# EasyEDA Pro project 功率计pcb.epro

# Schematic Schematic1
Board Name: Board1; Create Date: 2025-11-07; Page Name: P1; Project Name: 【单片机】STM32F103C8T6功率计; Schematic Name: Schematic1; Update Date: 2025-11-07; Company: 嘉立创EDA; Page Size: A4; Version: V1.0
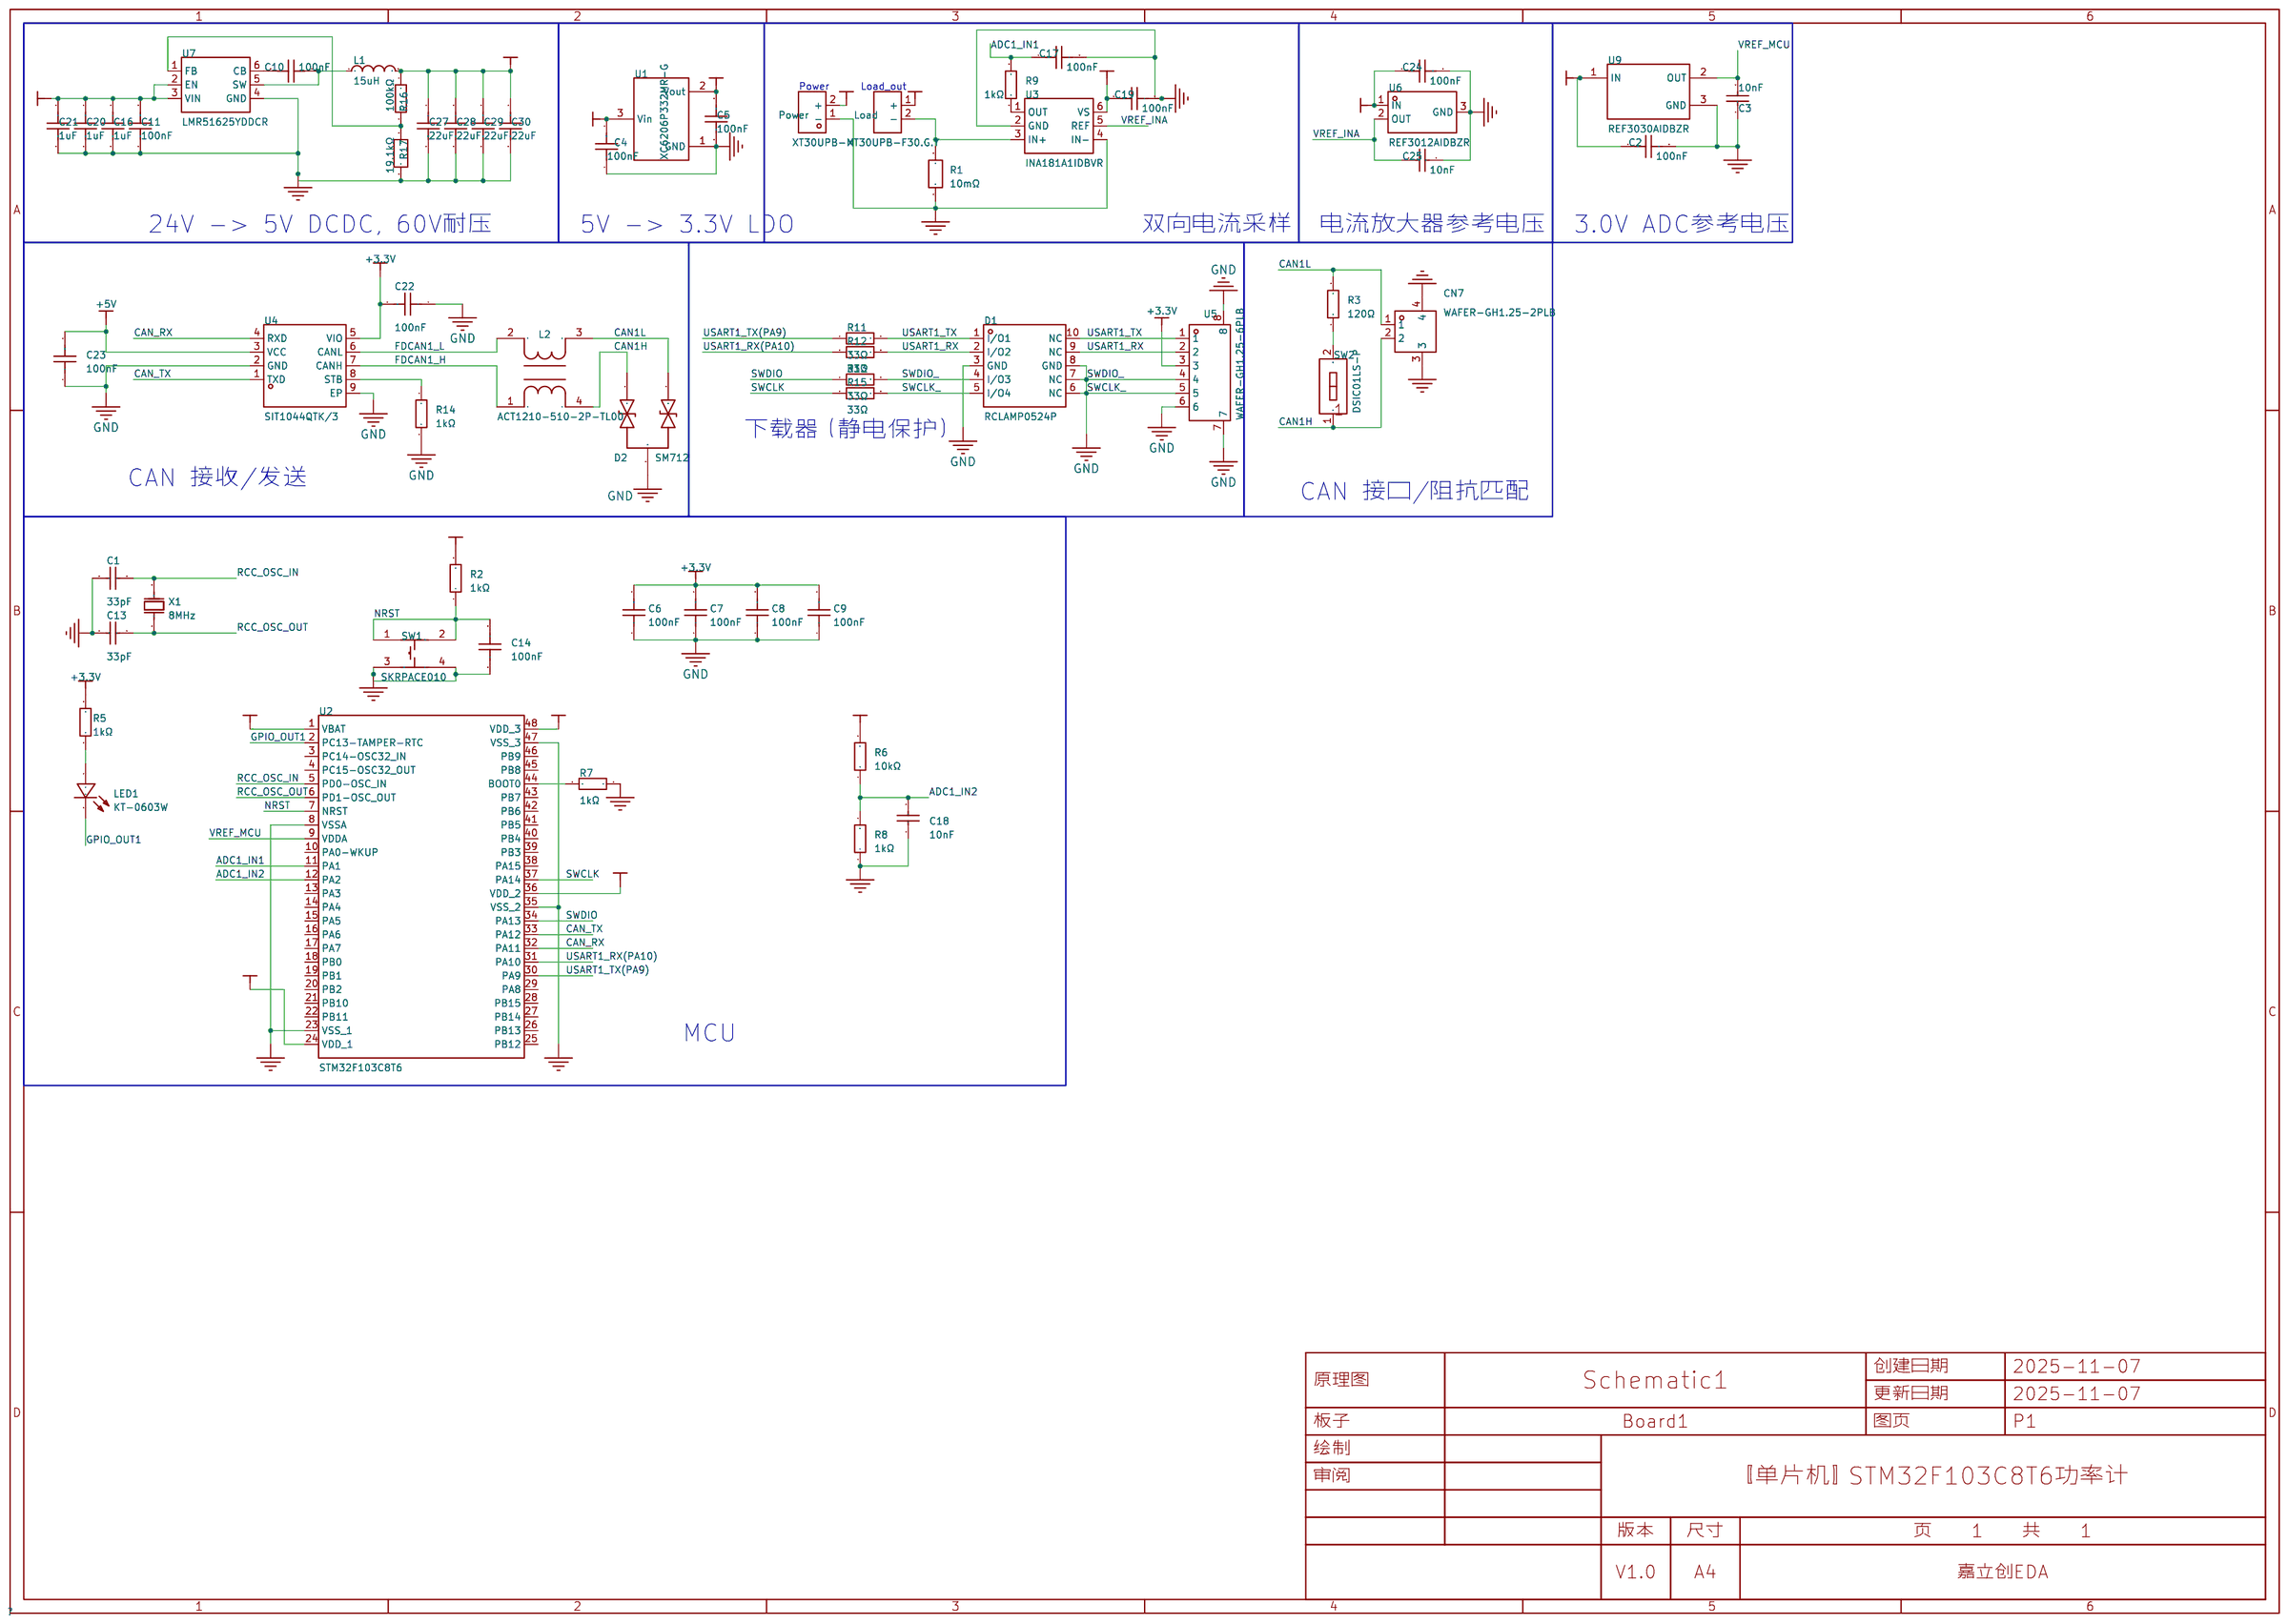
[diagram p0: schematic sheet]

## Parts
C1  33pF  [C0603]
C2  100nF  [C0603]
C3  10nF  [C0603]
C4  100nF  [C0603]
C5  100nF  [C0603]
C6  100nF  [C0603]
C7  100nF  [C0603]
C8  100nF  [C0603]
C9  100nF  [C0603]
C10  100nF  [C0603]
C11  100nF  [C0603]
C13  33pF  [C0603]
C14  100nF  [C0603]
C16  1uF  [C0603]
C17  100nF  [C0603]
C18  10nF  [C0603]
C19  100nF  [C0603]
C20  1uF  [C0603]
C21  1uF  [C0603]
C22  100nF  [C0603]
C23  100nF  [C0603]
C24  100nF  [C0603]
C25  10nF  [C0603]
C27  22uF  [C0603]
C28  22uF  [C0603]
C29  22uF  [C0603]
C30  22uF  [C0603]
CN7  WAFER-GH1.25-2PLB  [CONN-TH_2P-P1.25_XUNPU_WAFER-GH1.25-2PLB]
D1  RCLAMP0524P  [DFN2510-10_L2.5-W1.0-P0.50-BL]
D2  SM712  [SOT-23-3_L2.9-W1.3-P1.90-LS2.4-BR]
L1  15uH  [IND-SMD_L5.7-W5.2_GSM0530]
L2  ACT1210-510-2P-TL00  [FILTER-SMD_4P-L3.2-W2.5-BL_ACT1210]
LED1  KT-0603W  [LED0603-R-RD_WHITE]
Load  XT30UPB-F30.G.Y  [CONN-TH_XT30UPB-F]
Power  XT30UPB-M  [CONN-TH_XT30UPB-M]
R1  10mΩ  [R2512]
R2  1kΩ  [R0603]
R3  120Ω  [R0603]
R5  1kΩ  [R0603]
R6  10kΩ  [R0603]
R7  1kΩ  [R0603]
R8  1kΩ  [R0603]
R9  1kΩ  [R0603]
R11  33Ω  [R0603]
R12  33Ω  [R0603]
R13  33Ω  [R0603]
R14  1kΩ  [R0603]
R15  33Ω  [R0603]
R16  100kΩ  [R0603]
R17  19.1kΩ  [R0603]
SW1  SKRPACE010  [KEY-SMD_4P-L4.2-W3.2-P2.20-LS4.6]
SW2  DSIC01LS-P  [SW-SMD_2P-L3.5-W6.1-P2.54-LS9.8]
U1  XC6206P332MR-G  [SOT-23-3_L2.9-W1.6-P1.90-LS2.8-BR]
U2  STM32F103C8T6  [LQFP-48_L7.0-W7.0-P0.50-LS9.0-BL]
U3  INA181A1IDBVR  [SOT-23-6_L2.9-W1.6-P0.95-LS2.8-TL]
U4  SIT1044QTK/3  [TDFN-8_L3.0-W3.0-P0.65-BL-EP]
U5  WAFER-GH1.25-6PLB  [CONN-SMD_6P-P1.25_XUNPU_WAFER-GH1.25-6PLB]
U6  REF3012AIDBZR  [SOT-23-3_L2.9-W1.3-P1.90-LS2.4-BR]
U7  LMR51625YDDCR  [SOT-23-6_L2.9-W1.6-P0.95-LS2.8-BL]
U9  REF3030AIDBZR  [SOT-23-3_L2.9-W1.6-P1.90-LS2.8-BR]
X1  8MHz  [CRYSTAL-SMD_L5.0-W3.2]

## Library data of the parts
C1 C13 = CL10C330JB8NNNC: 容值:33pF;精度:±5%;额定电压:50V;温度系数:C0G;; LCSC Part Name: 33pF ±5% 50V; Supplier Part: C1663; Manufacturer: SAMSUNG(三星); Supplier Footprint: 0603; JLCPCB Part Class: Basic Part; Datasheet: https://item.szlcsc.com/datasheet/CL10C330JB8NNNC/2015.html; Supplier: LCSC; Tolerance: ±5%; Voltage Rating: 50V; Temperature Coefficient: C0G
C2 C4 C5 C10 C11 C14 C17 C19 C22-C24 = CC0603KRX7R9BB104: 容值:100nF;精度:±10%;额定电压:50V;温度系数:X7R;; LCSC Part Name: 100nF ±10% 50V; Supplier Part: C14663; Manufacturer: YAGEO(国巨); Supplier Footprint: 0603; JLCPCB Part Class: Basic Part; Datasheet: https://item.szlcsc.com/datasheet/CC0603KRX7R9BB104/15331.html; Supplier: LCSC; Tolerance: ±10%; Voltage Rating: 50V; Temperature Coefficient: X7R
C3 C18 C25 = 0603B103K500NT: 容值:10nF;精度:±10%;额定电压:50V;温度系数:X7R;; LCSC Part Name: 10nF ±10% 50V; Supplier Part: C57112; Manufacturer: FH(风华); Supplier Footprint: 0603; JLCPCB Part Class: Basic Part; Datasheet: https://item.szlcsc.com/datasheet/0603B103K500NT/58143.html; Supplier: LCSC; Tolerance: ±10%; Voltage Rating: 50V; Temperature Coefficient: X7R
C6-C9 = CC0603KRX7R9BB104: 容值:100nF;精度:±10%;额定电压:50V;材质(温度系数):X7R;; LCSC Part Name: 100nF ±10% 50V; Supplier Part: C14663; Manufacturer: YAGEO(国巨); Supplier Footprint: 0603; JLCPCB Part Class: Basic Part; Datasheet: https://atta.szlcsc.com/upload/public/pdf/source/20180910/C282072_33301C7F631E79921B82A8DAC6BCC5B3.pdf; Supplier: LCSC; Tolerance: ±10%; Voltage Rating: 50V; Temperature Coefficient: X7R; Voltage Rated: 50V
C16 C20 C21 = CL10A105KB8NNNC: 容值:1uF;精度:±10%;额定电压:50V;温度系数:X5R;; LCSC Part Name: 1uF ±10% 50V; Supplier Part: C15849; Manufacturer: SAMSUNG(三星); Supplier Footprint: 0603; JLCPCB Part Class: Basic Part; Datasheet: https://item.szlcsc.com/datasheet/CL10A105KB8NNNC/16531.html; Supplier: LCSC; Tolerance: ±10%; Voltage Rating: 50V; Temperature Coefficient: X5R
C27-C30 = CL10A226MQ8NRNC: 容值:22uF;精度:±20%;额定电压:6.3V;温度系数:X5R;; LCSC Part Name: 22uF ±20% 6.3V; Supplier Part: C59461; Manufacturer: SAMSUNG(三星); Supplier Footprint: 0603; JLCPCB Part Class: Basic Part; Datasheet: https://item.szlcsc.com/datasheet/CL10A226MQ8NRNC/60514.html; Supplier: LCSC; Tolerance: ±20%; Voltage Rating: 6.3V; Temperature Coefficient: X5R
CN7 = WAFER-GH1.25-2PLB: 插针结构:1x2P;间距:1.25mm;安装方式:立贴;参考系列:GH;总PIN数:2P;排数:1;每排PIN数:2;额定电流:1A;工作温度范围:-25℃~+85℃;; LCSC Part Name: 1x2P 间距:1.25mm 立贴 系列:GH; Supplier Part: C3029368; Manufacturer: XUNPU(讯普); Supplier Footprint: SMD,P=1.25mm; JLCPCB Part Class: 扩展库; Datasheet: https://atta.szlcsc.com/upload/public/pdf/source/20220527/44F824AAC8C2B617205E15955FF9C23D.pdf; Supplier: LCSC; Pins Structure: 1x2P; Pitch: 1.25mm; Mounting Style: 立贴; Reference Series: GH; Number of Pins: 2P; Number of Rows: 1; Number of PINs Per Row: 2; Current Rating (Max): 1A; Operating Temperature Range: -25℃~+85℃
D1 = RCLAMP0524P_C907837: 极性:单向;反向截止电压(Vrwm):5V;最大钳位电压:17V;峰值脉冲电流(Ipp):4.5A;击穿电压:6.8V;; Supplier Part: C907837; Manufacturer: TECH PUBLIC(台舟); Supplier Footprint: DFN2510-10; JLCPCB Part Class: 扩展库; Datasheet: https://atta.szlcsc.com/upload/public/pdf/source/20210810/AE3DE9AC94AD2A317FD9BEA10653400F.pdf; Supplier: LCSC; polarity: 单向; Reverse Stand-Off Voltage (Vrwm): 5V; Maximum Clamping Voltage: 17V; Peak Pulse Current (Ipp): 4.5A; Breakdown Voltage: 6.8V; Reverse Leakage Current (Ir): 80nA; Number of Lines: 四路; Operating Temperature: -55℃~+125℃; level of protection: IEC 61000-4-2; Type: ESD
D2 = SM712_C521963: 极性:双向;反向截止电压(Vrwm):12V；7V;最大钳位电压:15V；25V;峰值脉冲电流(Ipp):7A;峰值脉冲功率(Ppp):150W;击穿电压:7.5V；13.3V;; Supplier Part: C521963; Manufacturer: TECH PUBLIC(台舟); Supplier Footprint: SOT-23; JLCPCB Part Class: 扩展库; Datasheet: https://atta.szlcsc.com/upload/public/pdf/source/20210810/E76C7C1824B0CB2A5B8963B3ABCE2DCE.pdf; Supplier: LCSC; polarity: 双向; Reverse Stand-Off Voltage (Vrwm): 12V；7V; Maximum Clamping Voltage: 15V；25V; Peak Pulse Current (Ipp): 7A; Peak Pulse Power Dissipation (Ppp): 150W; Breakdown Voltage: 7.5V；13.3V; Reverse Leakage Current (Ir): 500nA；10nA; Number of Lines: 双路; Operating Temperature: -55℃~+125℃; level of protection: IEC 61000-4-2; Type: ESD
L1 = SRG0530-150-M: 电感值:15uH;精度:±20%;额定电流:2.5A;饱和电流(Isat):3A;类型:一体成型电感;; LCSC Part Name: 15μH ±20% 3A; Supplier Part: C53462979; Manufacturer: JIERR(捷而瑞); Supplier Footprint: SMD,5.7x5.2mm; JLCPCB Part Class: Extended Part; Datasheet: https://item.szlcsc.com/datasheet/SRG0530-150-M/56628174.html; Supplier: LCSC; Tolerance: ±20%; Current Rating: 2.5A; Current - Saturation(Isat): 3A; DC Resistance(DCR): 218mΩ; Type: 一体成型电感
L2 = ACT1210-510-2P-TL00: 线路数:2;电感 @ 频率:51uH@100kHz;阻抗 @ 频率:2.6kΩ@10MHz;直流电阻(DCR):700mΩ;; LCSC Part Name: 两路 共模滤波器 阻抗2.6kΩ@10MHz; Supplier Part: C95572; Manufacturer: TDK; Supplier Footprint: 3.2x2.5mm; JLCPCB Part Class: 扩展库; Datasheet: https://atta.szlcsc.com/upload/public/pdf/source/20171113/C95572_15105616815011116176.pdf; Supplier: LCSC; Number of Lines: 2; Current Rating: 200mA; Inductance @ Frequency: 51uH@100kHz; Voltage Rating - DC: 80V; Impedance @ Frequency: 2.6kΩ@10MHz; DC Resistance (DCR): 700mΩ; Operating Temperature: -55℃~+150℃
LED1 = KT-0603W: 发光颜色:白色;; LCSC Part Name: 0603 白灯 高亮; Supplier Part: C2290; Manufacturer: KENTO; Supplier Footprint: 0603; JLCPCB Part Class: 基础库; Datasheet: https://atta.szlcsc.com/upload/public/pdf/source/20221101/4C23D5C85BA051E44A00B833D0A41468.pdf; Supplier: LCSC; Emitted Color: 白色
Load = XT30UPB-F30.G.Y: 类别:-;类型1:-;; LCSC Part Name: AMASS(艾迈斯)直立焊板式连接器XT30UPB30-F.G.*; Supplier Part: C108769; Manufacturer: AMASS(艾迈斯); JLCPCB Part Class: Extended Part; Datasheet: https://item.szlcsc.com/datasheet/XT30UPB-F30.G.Y/109989.html; Supplier: LCSC; Type: 航模插头; Colour: 黄色; RatedVoltage: DC 500V; InterfaceType: 母头; MetalMaterial: 镀金; InsulationMaterial: PA; RatedCurrent: 15A; contact resistance: 0.65mΩ
Power = XT30UPB-M: 类别:-;类型1:-;; LCSC Part Name: AMASS(艾迈斯)板载立式 航模锂电池控制器连接器插头 公头XT30UPB-M; Supplier Part: C428721; Manufacturer: AMASS(艾迈斯); JLCPCB Part Class: Extended Part; Datasheet: https://item.szlcsc.com/datasheet/XT30UPB-M/423831.html; Supplier: LCSC; Type: 航模插头; Colour: 黄色; RatedVoltage: DC 500V; InterfaceType: 公头; MetalMaterial: 镀金; InsulationMaterial: PA; RatedCurrent: 15A; contact resistance: 0.65mΩ
R1 = RE2512F3R010: 电阻类型:采样电阻；合金电阻;阻值:10mΩ;精度:±1%;功率:3W;温度系数:±50ppm/℃;; LCSC Part Name: 10mΩ 3W 2512 ±1%; Supplier Part: C46961753; Manufacturer: JIERR(捷而瑞); Supplier Footprint: 2512; JLCPCB Part Class: Extended Part; Datasheet: https://item.szlcsc.com/datasheet/RE2512F3R010/49133292.html; Supplier: LCSC; Type: 采样电阻；合金电阻; Tolerance: ±1%; Power(Watts): 3W; Temperature Coefficient: ±50ppm/℃
R2 R5 R7-R9 R14 = 0603WAF1001T5E: 电阻类型:厚膜电阻;阻值:1kΩ;精度:±1%;功率:100mW;最大工作电压:75V;温度系数:±100ppm/℃;; LCSC Part Name: 1kΩ ±1% 100mW 厚膜电阻; Supplier Part: C21190; Manufacturer: UNI-ROYAL(厚声); Supplier Footprint: 0603; JLCPCB Part Class: Basic Part; Datasheet: https://atta.szlcsc.com/upload/public/pdf/source/20200306/C422600_1E6D84923E4A46A82E41ADD87F860B5C.pdf; Supplier: LCSC; Type: 厚膜电阻; Tolerance: ±1%; Power(Watts): 100mW; Overload Voltage (Max): 75V; Temperature Coefficient: ±100ppm/℃; Operating Temperature Range: -55℃~+155℃
R3 = 0603WAF1200T5E: 电阻类型:厚膜电阻;阻值:120Ω;精度:±1%;功率:100mW;工作电压:75V;温度系数:±100ppm/℃;; LCSC Part Name: 120Ω ±1% 100mW 厚膜电阻; Supplier Part: C22787; Manufacturer: UNI-ROYAL(厚声); Supplier Footprint: 0603; JLCPCB Part Class: Basic Part; Datasheet: https://item.szlcsc.com/datasheet/0603WAF1200T5E/23514.html; Supplier: LCSC; Type: 厚膜电阻; Tolerance: ±1%; Power(Watts): 100mW; Voltage-Supply(Max): 75V; Temperature Coefficient: ±100ppm/℃; Operating Temperature: -55℃~+155℃
R6 = 0603WAF1002T5E: 电阻类型:厚膜电阻;阻值:10kΩ;精度:±1%;功率:100mW;工作电压:75V;温度系数:±100ppm/℃;; LCSC Part Name: 厚膜电阻 10kΩ ±1% 100mW; Supplier Part: C25804; Manufacturer: UNI-ROYAL(厚声); Supplier Footprint: 0603; JLCPCB Part Class: Basic Part; Datasheet: https://item.szlcsc.com/datasheet/0603WAF1002T5E/26547.html; Supplier: LCSC; Type: 厚膜电阻; Tolerance: ±1%; Power(Watts): 100mW; Voltage-Supply(Max): 75V; Temperature Coefficient: ±100ppm/℃; Operating Temperature: -55℃~+155℃
R11-R13 R15 = 0603WAF330JT5E: 电阻类型:厚膜电阻;阻值:33Ω;精度:±1%;功率:100mW;工作电压:75V;温度系数:±100ppm/℃;; LCSC Part Name: 33Ω ±1% 100mW 厚膜电阻; Supplier Part: C23140; Manufacturer: UNI-ROYAL(厚声); Supplier Footprint: 0603; JLCPCB Part Class: Basic Part; Datasheet: https://item.szlcsc.com/datasheet/0603WAF330JT5E/23867.html; Supplier: LCSC; Type: 厚膜电阻; Tolerance: ±1%; Power(Watts): 100mW; Voltage-Supply(Max): 75V; Temperature Coefficient: ±100ppm/℃; Operating Temperature: -55℃~+155℃
R16 = 0603WAF1003T5E: 电阻类型:厚膜电阻;阻值:100kΩ;精度:±1%;功率:100mW;工作电压:75V;温度系数:±100ppm/℃;; LCSC Part Name: 100kΩ ±1% 100mW 厚膜电阻; Supplier Part: C25803; Manufacturer: UNI-ROYAL(厚声); Supplier Footprint: 0603; JLCPCB Part Class: Basic Part; Datasheet: https://item.szlcsc.com/datasheet/0603WAF1003T5E/26546.html; Supplier: LCSC; Type: 厚膜电阻; Tolerance: ±1%; Power(Watts): 100mW; Voltage-Supply(Max): 75V; Temperature Coefficient: ±100ppm/℃; Operating Temperature: -55℃~+155℃
R17 = FRC0603F1912TS: 电阻类型:厚膜电阻;阻值:19.1kΩ;精度:±1%;功率:100mW;工作电压:75V;温度系数:±100ppm/℃;; LCSC Part Name: 19.1kΩ ±1% 100mW 厚膜电阻; Supplier Part: C2960926; Manufacturer: FOJAN(富捷); Supplier Footprint: 0603; JLCPCB Part Class: Extended Part; Supplier: LCSC; Type: 厚膜电阻; Tolerance: ±1%; Power(Watts): 100mW; Voltage-Supply(Max): 75V; Temperature Coefficient: ±100ppm/℃; Operating Temperature: -55℃~+155℃
SW1 = SKRPACE010: 电路结构:单刀单掷;按钮形状:椭圆形按钮;安装方式:立贴;开关长度:4.2mm;开关宽度:3.2mm;开关高度:2.5mm;触点电流:50mA;额定电压:16V;带灯:-;工作寿命:-;; LCSC Part Name: 4.2*3.2*2.5mm 立贴 轻触开关; Supplier Part: C139797; Manufacturer: ALPSALPINE(阿尔卑斯阿尔派); Supplier Footprint: SMD-4P,4.2x3.2mm; JLCPCB Part Class: Extended Part; Datasheet: https://item.szlcsc.com/datasheet/SKRPACE010/151122.html; Supplier: LCSC; Circuit: 单刀单掷; Actuator Style: 椭圆形按钮; Mounting Type: 立贴; Length: 4.2mm; Width: 3.2mm; Switch Height: 2.5mm; Contact Current: 50mA; Voltage Rating: 16V
SW2 = DSIC01LS-P: 类型:平拨,凸起式;电路结构:单刀单掷;开关位数:1位;额定电流:25mA;额定电压:24V;工作寿命:3千次;颜色:黑色;; LCSC Part Name: 平拨,凸起式 1位拨码开关; Supplier Part: C600988; Manufacturer: XKB Connection(中国星坤); Supplier Footprint: SMD; JLCPCB Part Class: Extended Part; Datasheet: https://item.szlcsc.com/datasheet/DSIC01LS-P/631008.html; Supplier: LCSC; Type: 平拨,凸起式; Circuit: 单刀单掷; Number of Positions: 1位; Termination Style: 鸥翼型; Current Rating: 25mA; Voltage Rating: 24V; Operating Temperature: -20℃~+70℃; Operating Life: 3千次; Color: 黑色
U1 = XC6206P332MR-G_C5446: 输出类型:固定;工作电压:6V;输出电压:3.3V;输出电流:200mA;电源纹波抑制比(PSRR):-;输出极性:正极;; LCSC Part Name: 3.3V 200mA 6V; Supplier Part: C5446; Manufacturer: TOREX(特瑞仕); Supplier Footprint: SOT-23-3L; JLCPCB Part Class: Basic Part; Datasheet: https://item.szlcsc.com/datasheet/XC6206P332MR-G/5896.html; Supplier: LCSC; Output Type: 固定; Voltage - Supply: 6V; Output Voltage: 3.3V; Output Current: 200mA; standby current: 1uA; Features: 过流保护; Operating Temperature: -40℃~+85℃@(Ta); Output Configuration: 正极; Number of Outputs: 1
U2 = STM32F103C8T6: CPU内核:ARM-M3;CPU最大主频:72MHz;应用领域:-;; LCSC Part Name: 主流增强型ARM Cortex-M3 MCU，具有64 KB Flash、72 MHz CPU、电机控制、USB和CAN; Supplier Part: C8734; Manufacturer: ST(意法半导体); Supplier Footprint: LQFP-48(7x7); JLCPCB Part Class: Extended Part; Datasheet: https://item.szlcsc.com/datasheet/STM32F103C8T6/9243.html; Supplier: LCSC; CPU Core: ARM-M3; CPU Maximum Speed: 72MHz; Program Storage Size: 64KB; Program Memory Type: FLASH; Number of I/O: 37; ADC (Bit): 12bit; Voltage - Supply: 2V~3.6V
U3 = INA181A1IDBVR: 放大器数:单路;; Supplier Part: C2058943; Manufacturer: TI(德州仪器); Supplier Footprint: SOT-23-6; JLCPCB Part Class: Extended Part; Datasheet: https://www.ti.com/cn/lit/gpn/ina2181; Supplier: LCSC; Number of Channels: 单路; Supply Current: 260uA; Operating Temperature: -40℃~+125℃
U4 = SIT1044QTK/3: 类型:CAN-FD收发器;数据速率:5Mbps;; Supplier Part: C5308063; Manufacturer: SIT(芯力特); Supplier Footprint: DFN-8(3x3); JLCPCB Part Class: 扩展库; Datasheet: https://atta.szlcsc.com/upload/public/pdf/source/20241105/7D4F6AF505B38E348F613F026F5787F9.pdf; Supplier: LCSC; Type: CAN-FD收发器; Data Rate: 5Mbps; Supply Voltage: 4.75V~5.25V; Operating Temperature: -40℃~+125℃
U5 = WAFER-GH1.25-6PLB: 插针结构:1x6P;间距:1.25mm;安装方式:立贴;参考系列:GH;总PIN数:6P;排数:1;每排PIN数:6;额定电流:1A;工作温度范围:-25℃~+85℃;; LCSC Part Name: 1x6P 间距:1.25mm 立贴 系列:GH; Supplier Part: C3029372; Manufacturer: XUNPU(讯普); Supplier Footprint: SMD,P=1.25mm; JLCPCB Part Class: 扩展库; Datasheet: https://atta.szlcsc.com/upload/public/pdf/source/20220527/44F824AAC8C2B617205E15955FF9C23D.pdf; Supplier: LCSC; Pins Structure: 1x6P; Pitch: 1.25mm; Mounting Style: 立贴; Reference Series: GH; Number of Pins: 6P; Number of Rows: 1; Number of PINs Per Row: 6; Current Rating (Max): 1A; Operating Temperature Range: -25℃~+85℃
U6 = REF3012AIDBZR: 输出类型:固定;工作电压:1.8V~5.5V;输出电压:1.25V;输出电流:25mA;精度:±0.2%;; Supplier Part: C34674; Manufacturer: TI(德州仪器); Supplier Footprint: SOT-23; JLCPCB Part Class: Extended Part; Datasheet: https://www.ti.com/lit/ds/symlink/ref30.pdf; Supplier: LCSC; Output Type: 固定; Voltage - Supply: 1.8V~5.5V; Output Voltage: 1.25V; Output Current: 25mA; Tolerance: ±0.2%; Temperature Coefficient: 75ppm/℃; Reference Type: 串联; Quiescent Current: 50uA; Noise - 1/10Hz to 10Hz: 14uVp-p; Noise - 10Hz to 10kHz: 42uVrms; Operating Temperature: -40℃~+125℃@(Ta)
U7 = LMR51625YDDCR: 功能类型:降压型;工作电压:4.3V~60V;输出电压:800mV~30V;输出电流:2.5A;输出类型:可调;; LCSC Part Name: 降压型 2.5A 4.3V~60V; Supplier Part: C44991044; Manufacturer: TI(德州仪器); Supplier Footprint: SOT-23-6; JLCPCB Part Class: Extended Part; Datasheet: https://www.ti.com.cn/cn/lit/ds/symlink/lmr51625.pdf; Supplier: LCSC; Function: 降压型; Voltage - Supply: 4.3V~60V; Output Voltage: 800mV~30V; Output Current: 2.5A; Frequency - Switching: 1.1MHz; Operating Temperature: -40℃~+150℃@(TJ); Synchronous Rectifier: 是; Topology: 降压式; Quiescent Current: 29uA; Switch tube (built-in/external): 内置; Output Type: 可调
U9 = REF3030AIDBZR: 输出类型:固定;工作电压:3.05V~5.5V;输出电压:3V;输出电流:25mA;精度:±0.2%;; LCSC Part Name: 3.05V~5.5V 串联 50uA 75ppm/℃; Supplier Part: C38423; Manufacturer: TI(德州仪器); Supplier Footprint: SOT-23; JLCPCB Part Class: Extended Part; Datasheet: https://www.ti.com/lit/ds/symlink/ref30.pdf; Supplier: LCSC; Output Type: 固定; Voltage - Supply: 3.05V~5.5V; Output Voltage: 3V; Output Current: 25mA; Tolerance: ±0.2%; Temperature Coefficient: 75ppm/℃; Reference Type: 串联; Quiescent Current: 50uA; Noise - 1/10Hz to 10Hz: 33uVp-p; Noise - 10Hz to 10kHz: 94uVrms; Operating Temperature: -40℃~+125℃@(Ta)
X1 = X50328MSB2GI: 晶振类型:贴片晶振;频率:8MHz;常温频差:±10ppm;负载电容:20pF;频率稳定度:±20ppm;; LCSC Part Name: YSX530GA 8MHZ 2P 5032 20PF ±10PPM -40~85℃ (±20PPM); Supplier Part: C115962; Manufacturer: YXC(扬兴晶振); Supplier Footprint: SMD5032-2P; JLCPCB Part Class: Basic Part; Datasheet: https://item.szlcsc.com/datasheet/X50328MSB2GI/117214.html; Supplier: LCSC; Type: 贴片晶振; Normal temperature Frequency Tolerance: ±10ppm; Load Capacitance: 20pF; Frequency Stability: ±20ppm; Operating Temperature: -40℃~+85℃

## Nets
+3.3V: C2.1 C5.2 C6.2 C7.2 C8.2 C9.2 C19.1 C22.2 C24.1 R2.2 R5.2 U1.2(Vout) U2.1(VBAT) U2.24(VDD_1) U2.36(VDD_2) U2.48(VDD_3) U3.6(VS) U4.5(VIO) U5.3 U6.1(IN) U9.1(IN)
+5V: C4.2 C23.2 C27.1 C28.1 C29.1 C30.1 L1.2 R16.1 U1.3(Vin) U4.3(VCC)
GND: C1.1 C2.2 C3.1 C4.1 C5.1 C6.1 C7.1 C8.1 C9.1 C11.1 C13.1 C14.1 C16.2 C17.2 C18.1 C19.2 C20.2 C21.2 C22.1 C23.1 C24.2 C25.2 C27.2 C28.2 C29.2 C30.2 CN7.3 CN7.4 D1.3(GND) D1.8(GND) D2.3 Power.1(-) R1.1 R7.2 R8.1 R14.2 R17.2 SW1.3 SW1.4 U1.1(GND) U2.8(VSSA) U2.23(VSS_1) U2.35(VSS_2) U2.47(VSS_3) U3.2(GND) U3.4(IN-) U4.2(GND) U4.9(EP) U5.6 U5.7 U5.8 U6.3(GND) U7.4(GND) U9.3(GND)
VCC: C11.2 C16.1 C20.1 C21.1 Load.1(+) Power.2(+) R6.2 U7.2(EN) U7.3(VIN)
ADC1_IN1: C17.1 R9.2 U2.11(PA1)
ADC1_IN2: C18.2 R6.1 R8.2 U2.12(PA2)
CAN1H: CN7.2 D2.2 L2.4 SW2.1(PIN1)
CAN1L: CN7.1 D2.1 L2.3 R3.2
CAN_RX: U2.32(PA11) U4.4(RXD)
CAN_TX: U2.33(PA12) U4.1(TXD)
FDCAN1_H: L2.1 U4.7(CANH)
FDCAN1_L: L2.2 U4.6(CANL)
GPIO_OUT1: LED1.2(K) U2.2(PC13-TAMPER-RTC)
NRST: C14.2 R2.1 SW1.1 SW1.2 U2.7(NRST)
RCC_OSC_IN: C1.2 U2.5(PD0-OSC_IN) X1.2(OSC2)
RCC_OSC_OUT: C13.2 U2.6(PD1-OSC_OUT) X1.1(OSC1)
SWCLK: R15.1 U2.37(PA14)
SWCLK_: D1.5(I/O4) D1.6(NC) R15.2 U5.5
SWDIO: R13.1 U2.34(PA13)
SWDIO_: D1.4(I/O3) D1.7(NC) R13.2 U5.4
USART1_RX: D1.2(I/O2) D1.9(NC) R12.2 U5.2
USART1_RX(PA10): R12.1 U2.31(PA10)
USART1_TX: D1.1(I/O1) D1.10(NC) R11.2 U5.1
USART1_TX(PA9): R11.1 U2.30(PA9)
VREF_INA: C25.1 U3.5(REF) U6.2(OUT)
VREF_MCU: C3.2 U2.9(VDDA) U9.2(OUT)
$1N34: R9.1 U3.1(OUT)
$1N49: Load.2(-) R1.2 U3.3(IN+)
$1N78: R7.1 U2.44(BOOT0)
$1N106: LED1.1(A) R5.1
$1N115: R14.1 U4.8(STB)
$1N164: C10.1 L1.1 U7.5(SW)
$1N165: R16.2 R17.1 U7.1(FB)
$1N182: R3.1 SW2.2(PIN2)
$1N185: C10.2 U7.6(CB)

Not connected (* = marked no-connect by the designer): U2 3(PC14-OSC32_IN) 4(PC15-OSC32_OUT) 10(PA0-WKUP) 13(PA3) 14(PA4) 15(PA5) 16(PA6) 17(PA7) 18(PB0) 19(PB1) 20(PB2) 21(PB10) 22(PB11) 25(PB12) 26(PB13) 27(PB14) 28(PB15) 29(PA8) 38(PA15) 39(PB3) 40(PB4) 41(PB5) 42(PB6) 43(PB7) 45(PB8) 46(PB9)

## Notes on the sheet
- Power
- Load_out
- 24V -> 5V DCDC, 60V耐压
- 5V -> 3.3V LDO
- 双向电流采样
- 电流放大器参考电压
- 3.0V ADC参考电压
- 下载器（静电保护）
- CAN 接收/发送
- CAN 接口/阻抗匹配
- MCU

# Board PCB1
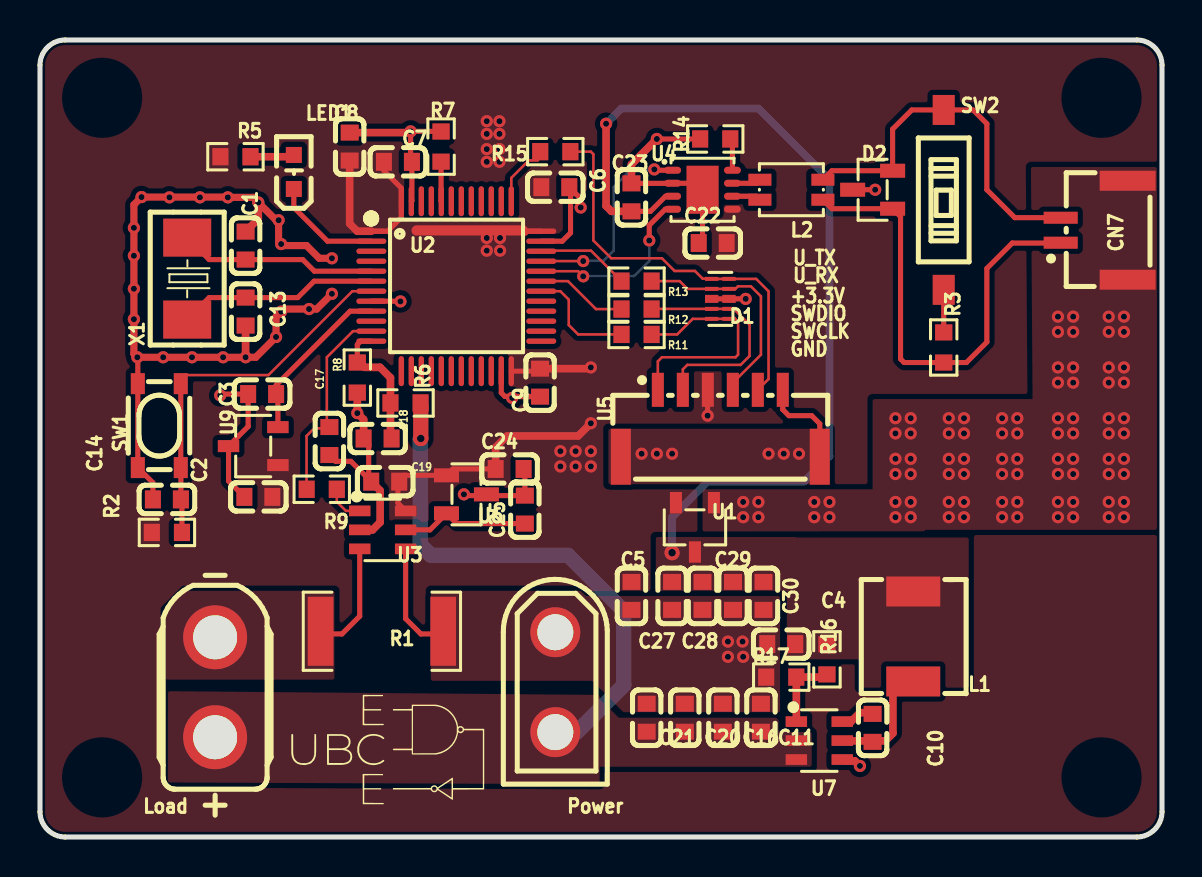
[diagram p1: board, top side]
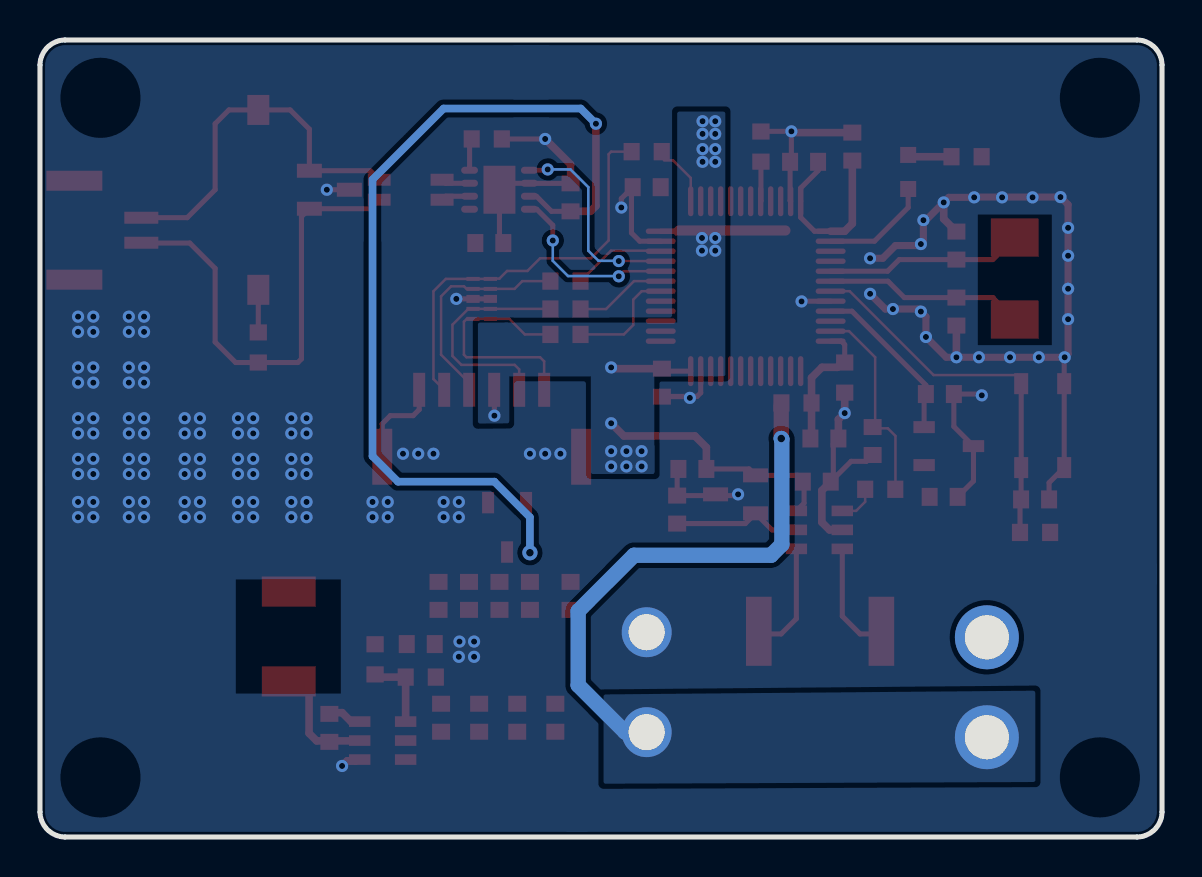
[diagram p2: board, bottom side, seen from below]

Outline 56.13 x 39.88 mm; copper layers: Top Layer, Bottom Layer. Coordinates in mm from the lower left corner of the outline.
Outline path: 0,38.61 0,1.27 arc(0.37,0.37) 1.27,0 54.86,0 arc(55.76,0.37) 56.13,1.27 56.13,38.61 arc(55.76,39.51) 54.86,39.88 1.27,39.88 arc(0.37,39.51) 0,38.61
Stack: Top Layer 0.035mm / Dielectric1 1.51mm FR4 er 4.5 / Bottom Layer 0.035mm

## Design rules (mm)
spacing copperThickness1oz (default): track to track 0.102, other pairs 0.152 to 0.3
spacing copperThickness2oz: track to track 0.203, other pairs 0.152 to 0.3
track width copperThickness1oz (default): min 0.127, default 0.127, max 2.54
track width copperThickness2oz: min 0.203, default 0.254, max 2.54
differential pair differentialPair (default): width min 0.127, default 0.254, max 2.54; gap min 0.152, default 0.152
net +3.3V uses noheat
net GND uses noheat
net +5V uses noheat
net VCC uses noheat
net $1N49 uses noheat
net 3V3 uses noheat

## Placement (name value [footprint] x y rotation side)
C1  33pF  [C0603]  10.29 29.59 270 top
C2  100nF  [C0603]  10.93 17.02 180 top
C3  10nF  [C0603]  11.11 22.16 0 top
C4  100nF  [C0603]  37.08 9.65 0 top
C5  100nF  [C0603]  29.59 12.06 90 top
C6  100nF  [C0603]  25.78 32.51 180 top
C7  100nF  [C0603]  17.91 33.78 180 top
C8  100nF  [C0603]  15.49 34.54 270 top
C9  100nF  [C0603]  25.02 22.73 90 top
C10  100nF  [C0603]  41.66 5.46 90 top
C11  100nF  [C0603]  36.07 5.97 270 top
C13  33pF  [C0603]  10.29 26.29 90 top
C14  100nF  [C0603]  6.35 16.89 0 top
C16  1uF  [C0603]  34.16 5.97 90 top
C17  100nF  [C0603]  14.48 19.81 270 top
C18  10nF  [C0603]  16.89 19.94 0 top
C19  100nF  [C0603]  17.27 17.78 180 top
C20  1uF  [C0603]  32.26 5.97 90 top
C21  1uF  [C0603]  30.35 5.97 90 top
C22  100nF  [C0603]  33.66 29.72 0 top
C23  100nF  [C0603]  29.59 32 270 top
C24  100nF  [C0603]  23.5 18.41 0 top
C25  10nF  [C0603]  24.26 16.38 90 top
C27  22uF  [C0603]  31.62 12.06 270 top
C28  22uF  [C0603]  33.15 12.06 270 top
C29  22uF  [C0603]  34.67 12.06 270 top
C30  22uF  [C0603]  36.19 12.06 270 top
CN7  WAFER-GH1.25-2PLB  [CONN-TH_2P-P1.25_XUNPU_WAFER-GH1.25-2PLB]  52.74 30.36 90 top
D1  RCLAMP0524P  [DFN2510-10_L2.5-W1.0-P0.50-BL]  34.04 26.92 90 top
D2  SM712  [SOT-23-3_L2.9-W1.3-P1.90-LS2.4-BR]  41.66 32.38 0 top
L1  15uH  [IND-SMD_L5.7-W5.2_GSM0530]  43.69 10.03 90 top
L2  ACT1210-510-2P-TL00  [FILTER-SMD_4P-L3.2-W2.5-BL_ACT1210]  37.59 32.38 270 top
LED1  KT-0603W  [LED0603-R-RD_WHITE]  12.7 33.27 90 top
Load  XT30UPB-F30.G.Y  [CONN-TH_XT30UPB-F]  8.76 7.49 90 top
Power  XT30UPB-M  [CONN-TH_XT30UPB-M]  25.78 7.75 270 top
R1  10mΩ  [R2512]  17.11 10.3 180 top
R2  1kΩ  [R0603]  6.35 15.24 180 top
R3  120Ω  [R0603]  45.21 24.49 270 top
R5  1kΩ  [R0603]  9.78 34.04 180 top
R6  10kΩ  [R0603]  18.29 21.72 0 top
R7  1kΩ  [R0603]  20.07 34.54 90 top
R8  1kΩ  [R0603]  15.88 22.99 90 top
R9  1kΩ  [R0603]  14.1 17.4 180 top
R11  33Ω  [R0603]  29.84 25.15 0 top
R12  33Ω  [R0603]  29.84 26.42 0 top
R13  33Ω  [R0603]  29.84 27.81 0 top
R14  1kΩ  [R0603]  33.78 34.92 180 top
R15  33Ω  [R0603]  25.78 34.29 0 top
R16  100kΩ  [R0603]  39.37 8.89 270 top
R17  19.1kΩ  [R0603]  37.08 8 180 top
SW1  SKRPACE010  [KEY-SMD_4P-L4.2-W3.2-P2.20-LS4.6]  5.97 20.58 270 top
SW2  DSIC01LS-P  [SW-SMD_2P-L3.5-W6.1-P2.54-LS9.8]  45.21 31.88 270 top
U1  XC6206P332MR-G  [SOT-23-3_L2.9-W1.6-P1.90-LS2.8-BR]  32.77 15.49 90 top
U2  STM32F103C8T6  [LQFP-48_L7.0-W7.0-P0.50-LS9.0-BL]  20.83 27.56 270 top
U3  INA181A1IDBVR  [SOT-23-6_L2.9-W1.6-P0.95-LS2.8-TL]  17.15 15.37 0 top
U4  SIT1044QTK/3  [TDFN-8_L3.0-W3.0-P0.65-BL-EP]  33.15 32.38 270 top
U5  WAFER-GH1.25-6PLB  [CONN-SMD_6P-P1.25_XUNPU_WAFER-GH1.25-6PLB]  34.04 20.7 0 top
U6  REF3012AIDBZR  [SOT-23-3_L2.9-W1.3-P1.90-LS2.4-BR]  21.34 17.14 180 top
U7  LMR51625YDDCR  [SOT-23-6_L2.9-W1.6-P0.95-LS2.8-BL]  38.99 4.83 270 top
U9  REF3030AIDBZR  [SOT-23-3_L2.9-W1.6-P1.90-LS2.8-BR]  10.67 19.56 0 top
X1  8MHz  [CRYSTAL-SMD_L5.0-W3.2]  7.37 27.94 90 top

## Footprints (pads in the part's own frame, mm; a bottom-side part is the same pattern mirrored in y, then rotated)
C0603
  rect 0.8x0.9 smd: 1(-0.7,0) 2(0.7,0)
CONN-SMD_6P-P1.25_XUNPU_WAFER-GH1.25-6PLB
  rect 0.6x1.7 smd: 1(-3.125,1.675) 2(-1.875,1.675) 3(-0.625,1.675) 4(0.625,1.675) 5(1.875,1.675) 6(3.125,1.675)
  rect 1x2.8 smd: 7(4.975,-1.675) 8(-4.975,-1.675)
CONN-TH_2P-P1.25_XUNPU_WAFER-GH1.25-2PLB
  rect 0.6x1.7 smd: 1(-0.625,1.675) 2(0.625,1.675)
  rect 1x2.8 smd: 3(2.475,-1.675) 4(-2.475,-1.675)
CONN-TH_XT30UPB-F
  round 3.2 hole 2.2: 1(-2.5,0) 2(2.5,0)
CONN-TH_XT30UPB-M
  round 2.5 hole 1.8: 1(-2.5,0) 2(2.5,0)
CRYSTAL-SMD_L5.0-W3.2
  rect 1.9x2.4 smd: 1(-2.05,0) 2(2.05,0)
DFN2510-10_L2.5-W1.0-P0.50-BL
  rect 0.2x0.665 smd: 1(-1,-0.433) 2(-0.5,-0.433) 4(0.5,-0.433) 5(1,-0.433) 6(1,0.433) 7(0.5,0.433) 9(-0.5,0.433) 10(-1,0.433)
  rect 0.4x0.665 smd: 3(0,-0.433) 8(0,0.433)
FILTER-SMD_4P-L3.2-W2.5-BL_ACT1210
  rect 0.6x1.15 smd: 1(-0.5,-1.575) 2(0.5,-1.575) 3(0.5,1.575) 4(-0.5,1.575)
IND-SMD_L5.7-W5.2_GSM0530
  rect 1.5x2.7 smd: 1(-2.25,0) 2(2.25,0)
KEY-SMD_4P-L4.2-W3.2-P2.20-LS4.6
  rect 1.05x0.7 smd: 1(-2.1,1.075) 2(2.1,1.075) 3(-2.1,-1.075) 4(2.1,-1.075)
LED0603-R-RD_WHITE
  rect 0.8x0.8 smd: 1(0.851,0) 2(-0.851,0)
LQFP-48_L7.0-W7.0-P0.50-LS9.0-BL
  oval 0.27x1.5 smd: 1(-2.75,-4.25) 2(-2.25,-4.25) 3(-1.75,-4.25) 4(-1.25,-4.25) 5(-0.75,-4.25) 6(-0.25,-4.25) 7(0.25,-4.25) 8(0.75,-4.25) 9(1.25,-4.25) 10(1.75,-4.25) 11(2.25,-4.25) 12(2.75,-4.25) 25(2.75,4.25) 26(2.25,4.25) 27(1.75,4.25) 28(1.25,4.25) 29(0.75,4.25) 30(0.25,4.25) 31(-0.25,4.25) 32(-0.75,4.25) 33(-1.25,4.25) 34(-1.75,4.25) 35(-2.25,4.25) 36(-2.75,4.25)
  oval 1.5x0.27 smd: 13(4.25,-2.75) 14(4.25,-2.25) 15(4.25,-1.75) 16(4.25,-1.25) 17(4.25,-0.75) 18(4.25,-0.25) 19(4.25,0.25) 20(4.25,0.75) 21(4.25,1.25) 22(4.25,1.75) 23(4.25,2.25) 24(4.25,2.75) 37(-4.25,2.75) 38(-4.25,2.25) 39(-4.25,1.75) 40(-4.25,1.25) 41(-4.25,0.75) 42(-4.25,0.25) 43(-4.25,-0.25) 44(-4.25,-0.75) 45(-4.25,-1.25) 46(-4.25,-1.75) 47(-4.25,-2.25) 48(-4.25,-2.75)
R0603
  rect 0.806x0.864 smd: 1(-0.753,0) 2(0.753,0)
R2512
  rect 1.282x3.456 smd: 1(-3.067,0) 2(3.067,0)
SOT-23-3_L2.9-W1.3-P1.90-LS2.4-BR
  rect 1.25x0.7 smd: 1(1,-0.95) 2(1,0.95) 3(-1,0)
SOT-23-3_L2.9-W1.6-P1.90-LS2.8-BR
  rect 1.07x0.6 smd: 1(1.235,-0.95) 2(1.235,0.95) 3(-1.235,0)
SOT-23-6_L2.9-W1.6-P0.95-LS2.8-BL
  rect 0.532x1.072 smd: 1(-0.95,-1.149) 2(0,-1.149) 3(0.95,-1.149) 4(0.95,1.149) 5(0,1.149) 6(-0.95,1.149)
SOT-23-6_L2.9-W1.6-P0.95-LS2.8-TL
  rect 1.072x0.532 smd: 1(-1.149,0.95) 2(-1.149,0) 3(-1.149,-0.95) 4(1.149,-0.95) 5(1.149,0) 6(1.149,0.95)
SW-SMD_2P-L3.5-W6.1-P2.54-LS9.8
  rect 1.5x1.1 smd: 1(-4.5,0) 2(4.5,0)
TDFN-8_L3.0-W3.0-P0.65-BL-EP
  oval 0.35x0.84 smd: 1(-0.975,-1.495) 2(-0.325,-1.495) 3(0.325,-1.495) 4(0.975,-1.495) 5(0.975,1.495) 6(0.325,1.495) 7(-0.325,1.495) 8(-0.975,1.495)
  rect 2.4x1.6 smd: 9(0,0)

## Nets
As in the schematic.

Pads without a net: U2 3 4 10 13 14 15 16 17 18 19 20 21 22 25 26 27 28 29 38 39 40 41 42 43 45 46

## Via types
v1: diameter 0.61, hole 0.305, Top Layer to Bottom Layer, 152 vias
v2: diameter 0.762, hole 0.381, Top Layer to Bottom Layer, 2 vias

## Routing (per net, layer and track width the routed paths; a pad name or vN(x,y) marks a point on that pad's centre or on a via; arc(x,y) is an arc through that point)
+3.3V: length 34
  Top Layer w0.254: C24.1 20.66,18.41 U6.1 18.23,18.09 17.91,17.77 17.91,16.7 U3.6 ; U5.3 33.4,22.37 v1(33.4,21.08) ; C7.2 17.21,33.34 18.08,32.47 U2.48 18.08,31 17.39,30.31 U2.1 ; U2.36 24.34,30.31 24.29,30.26 24.29,30.22 24.17,30.35 ; 24.89,23.3 24.88,23.31 U2.24
  Top Layer w0.381: U2.1 15.88,30.31 15.49,30.69 C8.2 ; C24.1 22.8,19.49 23.37,20.07 26.92,20.07 v1(27.56,20.7) ; v1(27.56,23.49) 27.5,23.43 C9.2
  Top Layer w0.508: 18.84,30.35 24.17,30.35
  vias: v1(22.35,35.81) v1(22.35,35.18) v1(22.35,34.42) v1(22.35,33.78) v1(22.35,29.97) v1(22.35,29.34) v1(22.99,35.81) v1(22.99,35.18) v1(22.99,34.42) v1(22.99,33.78) v1(23.02,29.97) v1(23.02,29.34) v1(26.03,19.3) v1(26.03,18.54) v1(26.8,19.3) v1(26.8,18.54) v1(27.56,19.3) v1(27.56,18.54)
+5V: length 45.6
  Top Layer w0.254: C23.2 30.54,31.3 31.3,32.06 U4.3
  Top Layer w0.381: v1(28.32,35.69) 28.32,31.57 28.59,31.3 C23.2
  Bottom Layer w0.381: v2(31.62,14.22) 31.62,16 33.4,17.78 38.23,17.78 39.5,19.05 39.5,32.89 35.94,36.45 29.08,36.45 v1(28.32,35.69)
GND: length 109.4
  Top Layer w0.254: v1(23.62,21.97) 23.68,22.03 C9.1 25.01,22.05 23.26,22.05 23.08,22.22 U2.23 ; R7.2 20.06,35.31 v1(18.54,35.31) 18.54,33.85 C7.1 18.61,31.84 U2.47 ; C23.1 31.65,32.7 U4.2 32.82,32.71 U4.9 33.15,29.91 C22.1 ; v1(18.03,26.8) 18.02,26.81 U2.8 ; U2.35 26.13,29.81 26.54,30.23 26.54,32.45 ; C6.1 26.54,32.45 ; 26.54,32.45 27.05,31.94 v1(27.05,31.5) ; D1.8 D1.3 v1(35.31,26.92) ; U3.4 18.29,10.92 19.06,10.16 20.21,10.16 ; 16.44,17.91 C19.2 ; 16.44,17.91 16.44,19.68 C18.1 ; 16.44,17.91 15.56,18.8 14.79,18.8 C17.2 ; C14.1 5.65,17.73 SW1.4 SW1.3 4.89,23.98 ; C24.2 24.26,18.35 C25.2 21.27,17.08 v1(21.21,17.14) ; U5.6 37.16,21.39 37.47,21.08 38.61,21.08 39.01,20.68 U5.7 ; 10.22,17.02 9.43,17.81 U9.3 10.41,20.54 C3.1 9.08,22.16 v1(9.02,22.1) ; D2.3 v1(41.78,32.38) ; v1(30.86,34.92) R14.2
  Top Layer w0.355: v1(14.61,27.18) 13.84,26.42 v1(13.46,26.42) 12.19,26.42 v1(12.06,26.29) 11.81,26.03 v1(11.81,25.02) 10.8,24 v1(10.29,24) v1(9.16,24) v1(7.61,24) v1(6.16,24) v1(4.87,24) 4.7,24.17 v1(4.7,25.91) v1(4.7,27.43) v1(4.7,29.08) v1(4.7,30.48) 4.7,31.64 v1(5.08,32.02) 9.38,32.02 v1(9.4,32) 10.67,32 v1(10.92,31.75) 11.81,30.86 v1(11.94,30.86) 11.94,29.79 v1(12.06,29.67) 12.14,29.59 13.34,29.59 13.97,28.96 v1(14.61,28.96)
  Top Layer w0.381: U3.2 16.64,15.37 17.02,15.75 17.02,17.33 C19.2 ; C8.1 18.48,35.24 v1(18.54,35.31) ; C13.1 v1(10.29,24) ; U7.4 40.27,3.88 40.33,3.81 40.77,3.81 v1(41.02,3.56) ; v1(10.92,31.75) 10.92,30.93 C1.1 ; 15.88,22.36 v1(15.88,21.21) 16.19,20.89 C18.1 ; C23.1 29.59,33.66 v1(30.86,34.92)
  vias: v1(6.48,32) v1(8,32) v1(30.1,19.18) v1(30.86,19.18) v1(31.62,19.18) v1(34.42,9.78) v1(34.42,9.02) v1(35.15,9.78) v1(35.18,16.76) v1(35.18,16) v1(35.18,9.02) v1(35.94,16.76) v1(35.94,16) v1(36.45,19.18) v1(37.21,19.18) v1(37.97,19.18) v1(38.74,16.76) v1(38.74,16) v1(39.5,16.76) v1(39.5,16) v1(42.8,20.95) v1(42.8,20.19) v1(42.8,18.92) v1(42.8,18.16) v1(42.8,16.76) v1(42.8,16) v1(43.56,20.95) v1(43.56,20.19) v1(43.56,18.92) v1(43.56,18.16) v1(43.56,16.76) v1(43.56,16) v1(45.47,20.95) v1(45.47,20.19) v1(45.47,18.92) v1(45.47,18.16) v1(45.47,16.76) v1(45.47,16) v1(46.23,20.95) v1(46.23,20.19) v1(46.23,18.92) v1(46.23,18.16) v1(46.23,16.76) v1(46.23,16) v1(48.13,20.95) v1(48.13,20.19) v1(48.13,18.92) v1(48.13,18.16) v1(48.13,16.76) v1(48.13,16) v1(48.9,20.95) v1(48.9,20.19) v1(48.9,18.92) v1(48.9,18.16) v1(48.9,16.76) v1(48.9,16) v1(50.93,26.03) v1(50.93,25.27) v1(50.93,23.49) v1(50.93,22.73) v1(50.93,20.95) v1(50.93,20.19) v1(50.93,18.92) v1(50.93,18.16) v1(50.93,16.76) v1(50.93,16) v1(51.69,26.03) v1(51.69,25.27) v1(51.69,23.49) v1(51.69,22.73) v1(51.69,20.95) v1(51.69,20.19) v1(51.69,18.92) v1(51.69,18.16) v1(51.69,16.76) v1(51.69,16) v1(53.47,26.03) v1(53.47,25.27) v1(53.47,23.49) v1(53.47,22.73) v1(53.47,20.95) v1(53.47,20.19) v1(53.47,18.92) v1(53.47,18.16) v1(53.47,16.76) v1(53.47,16) v1(54.23,26.03) v1(54.23,25.27) v1(54.23,23.49) v1(54.23,22.73) v1(54.23,20.95) v1(54.23,20.19) v1(54.23,18.92) v1(54.23,18.16) v1(54.23,16.76) v1(54.23,16)
VCC: length 26.7
  Top Layer w0.762: v2(19.05,19.94) 19.05,21.6
  Bottom Layer w0.762: v2(19.05,19.94) 19.02,19.91 19.02,14.64 19.56,14.1 26.42,14.1 29.21,11.3 29.21,7.6 26.86,5.25 Power.2
ADC1_IN1: length 10.3
  Top Layer w0.127: 13.34,17.39 13.34,20.07 13.72,20.45 14.41,20.45 C17.1 14.35,20.64 14.35,24 15.66,25.31 U2.11
ADC1_IN2: length 6.6
  Top Layer w0.254: U2.12 16.05,24.81 15.88,24.64 15.88,23.87
  Top Layer w0.381: 15.88,23.87 16.24,23.5 17.01,23.5 17.53,22.98 R6.1 17.53,20 17.59,19.94
CAN1H: length 19.4
  Top Layer w0.254: L2.4 39.62,33.33 D2.2 42.66,35.42 43.62,36.38 SW2.1 46.68,36.38 47.37,35.69 47.37,32.38 48.77,30.99 51.7,30.99
CAN1L: length 24.7
  Top Layer w0.254: 51.7,29.73 51.68,29.72 48.64,29.72 47.37,28.45 47.37,24.77 46.35,23.74 R3.2 43.23,23.74 43.05,23.92 43.05,31.04 D2.1 39.62,31.43 L2.3
CAN_RX: length 9.1
  Top Layer w0.127: U2.32 26.92,28.31 v1(27.18,28.05)
  Top Layer w0.254: v1(30.48,29.84) 30.48,30.61 31.28,31.41 U4.4
  Bottom Layer w0.127: v1(30.48,29.84) 30.48,28.83 29.72,28.07 27.19,28.07 v1(27.18,28.05)
CAN_TX: length 10.4
  Top Layer w0.127: v1(27.18,28.82) 25.09,28.82 U2.33
  Top Layer w0.254: U4.1 30.78,33.36 v1(30.73,33.4)
  Bottom Layer w0.127: v1(27.18,28.82) 27.19,28.83 28.19,28.83 28.7,29.34 28.7,32.51 29.59,33.4 v1(30.73,33.4)
FDCAN1_H: length 1.4
  Top Layer w0.254: 36.02,32.88 35.84,32.71 U4.7
FDCAN1_L: length 1.4
  Top Layer w0.254: 36.02,31.88 35.84,32.06 U4.6
GPIO_OUT1: length 5.5
  Top Layer w0.254: LED1.2 12.7,31.5 14.39,29.81 U2.2
NRST: length 19.1
  Top Layer w0.127: U2.7 15.62,27.31 11.43,23.11 7.24,23.11 7.04,22.92 SW1.1
  Top Layer w0.254: R2.1 7.1,16.84 C14.2 7.05,18.48 SW1.2 SW1.1
RCC_OSC_IN: length 9.9
  Top Layer w0.254: U2.5 13.73,28.31 13.15,28.89 C1.2 8.47,28.89 X1.2
RCC_OSC_OUT: length 10
  Top Layer w0.254: U2.6 13.71,27.81 12.89,26.99 8.47,26.99 X1.1
SWCLK: length 2.9
  Top Layer w0.127: 24.92,33.85 24.46,33.85 23.58,32.98 U2.37
SWCLK_: length 20.5
  Top Layer w0.127: U5.5 36.45,22.91 36.45,27.3 35.83,27.92 D1.5 D1.6 33.59,27.94 33.15,27.94 32.77,28.32 31.75,28.32 31.12,28.96 28.58,28.96 27.69,29.84 27.69,34.16 27.56,34.29 R15.2
SWDIO: length 4.7
  Top Layer w0.127: U2.34 25.11,29.34 27.57,29.34 R13.1
SWDIO_: length 11.1
  Top Layer w0.127: U5.4 34.67,22.39 34.67,22.73 36.07,24.13 36.07,27.05 35.57,27.55 34.92,27.55 34.79,27.42 D1.4 D1.7 32.39,27.42 32,27.81 R13.2
USART1_RX: length 11.4
  Top Layer w0.127: R12.2 30.61,26.42 D1.9 D1.2 34.71,26.42 35.5,25.63 35.5,24.07 35.05,23.62 32.38,23.62 32.16,23.4 U5.2
USART1_RX(PA10): length 4.6
  Top Layer w0.127: U2.31 25.08,27.81 26.42,27.81 27.81,26.42 R12.1
USART1_TX: length 11.9
  Top Layer w0.127: R11.2 31.88,25.15 32.66,25.92 D1.10 D1.1 34.78,25.92 34.93,25.78 34.93,24.13 34.8,24 31.12,24 30.91,23.8 U5.1
USART1_TX(PA9): length 5.7
  Top Layer w0.127: R11.1 26.92,25.15 26.45,25.62 26.45,26.89 26.03,27.31 U2.30
VREF_INA: length 6.5
  Top Layer w0.254: C25.1 20.85,15.68 U6.2 19.51,15.37 U3.5
VREF_MCU: length 8.4
  Top Layer w0.254: U2.9 15.51,26.31 11.81,22.61 C3.2 11.9,22.07 U9.2
$1N34: length 2
  Top Layer w0.127: R9.1 14.85,16.77 15.31,16.32 U3.1
$1N49: length 5.7
  Top Layer w0.254: 14.08,10.16 15.11,10.16 16,11.05 U3.3
$1N78: length 2
  Top Layer w0.254: U2.44 20.07,31.82 R7.1
$1N106: length 2.2
  Top Layer w0.381: 12.57,34.04 10.54,34.04 10.53,34.04 10.53,34.16
$1N115: length 1.6
  Top Layer w0.254: R14.1 34.64,34.82 U4.8
$1N164: length 6.4
  Top Layer w0.381: 43.69,7.91 43.58,8.02 43.04,8.02 42.67,7.66 42.67,5.19 42.29,4.81 40.28,4.81 40.27,4.83 U7.5
$1N165: length 3.7
  Top Layer w0.381: 37.84,5.9 37.84,8 R17.1 39.11,8 39.37,8.26
$1N182: length 2.1
  Top Layer w0.254: R3.1 SW2.2
$1N185: length 1.7
  Top Layer w0.381: C10.2 41.59,6.22 41.02,6.22 40.57,5.78 U7.6

## Copper pours and planes (outline as drawn; the poured copper is in the pictures)
+3.3V on Top Layer: -0.61,43.92 57.51,43.92 57.51,-0.61 -0.61,-0.61
+3.3V on Top Layer: 25.91,30.1 25.9,30.09 23.88,30.09 23.88,28.94 21.84,28.94 21.84,30.63 24.23,30.63 24.23,33.22 25.63,33.22 25.65,33.2 25.65,31.24 25.68,31.26 25.91,31.26
+3.3V on Bottom Layer: 28.45,19.68 28.45,18.16 28.45,18.16 25.39,18.16 25.39,19.68
+3.3V on Bottom Layer: 24.26,25.74 32.94,25.74 32.94,23.05 21.84,23.05 21.84,36.29 24.26,36.29
+3.3V on Bottom Layer: 25.4,24.26 28.58,24.26 28.58,18.16 25.4,18.16
+3.3V on Bottom Layer: 34.22,20.68 32.66,20.7 32.66,25.74 34.22,25.74
+5V on Top Layer: 30.81,15.01 37.87,15.01 37.87,12.32 30.81,12.32
+5V on Top Layer: 37.37,14.99 46.46,14.99 46.46,7.47 41.02,7.47 41.02,8.89 37.37,8.89
GND on Top Layer: 24.01,12.06 37.02,12.06 37.02,6.25 29.18,6.25 27.57,7.87 23.97,7.87 23.97,12.09
GND on Top Layer: 19.56,12.32 27.05,12.32 27.94,11.43 27.94,7.81 19.56,7.81
GND on Top Layer: 33.15,17.4 44.3,17.4 44.3,15.3 33.15,15.29
GND on Top Layer: 41.66,15.37 41.66,21.91 49.66,21.91 49.58,33.53 55.88,33.53 55.88,15.37
GND on Top Layer: 28.44,20.43 39.5,20.43 39.5,17.65 28.44,17.65
GND on Bottom Layer: -1.91,41.27 32.51,41.27 32.51,12.57 -1.91,12.57
GND on Bottom Layer: 28.7,18.29 57.15,18.29 57.15,-1.52 28.7,-1.52
GND on Bottom Layer: -1.91,13.72 29.84,13.72 29.84,-1.78 -1.91,-1.78
GND on Bottom Layer: 30.61,41.4 57.02,41.4 57.02,29.72 30.61,29.72
GND on Bottom Layer: 56.77,17.53 27.56,17.53 27.56,32 56.77,32
VCC on Top Layer: 28,7.11 28,2.64 6.4,2.73 6.4,7.3
VCC on Top Layer: 24.26,6.98 27.94,6.98 28.96,5.97 36.83,5.97 36.96,5.84 36.96,5.29 38.53,5.29 38.61,5.21 38.61,3.51 24.34,3.51 24.26,3.43
VCC on Bottom Layer: 27.94,7.13 27.94,2.67 6.34,2.75 6.34,7.32
$1N49 on Top Layer: 14.73,12.32 14.73,7.87 6.28,7.87 6.29,8.19 6.29,11.37 7.24,12.32

## Text on the board
Top Silkscreen Layer: +3.3V | SWDIO | SWCLK | GND | U_TX | U_RX
